# Altium schematic sheet Cooling_control.SchDoc: Cooling control
size A4; Engineer: Danel Tiitma; DocumentNumber: 8; Revision: 1; SheetNumber: 9; SheetTotal: 15
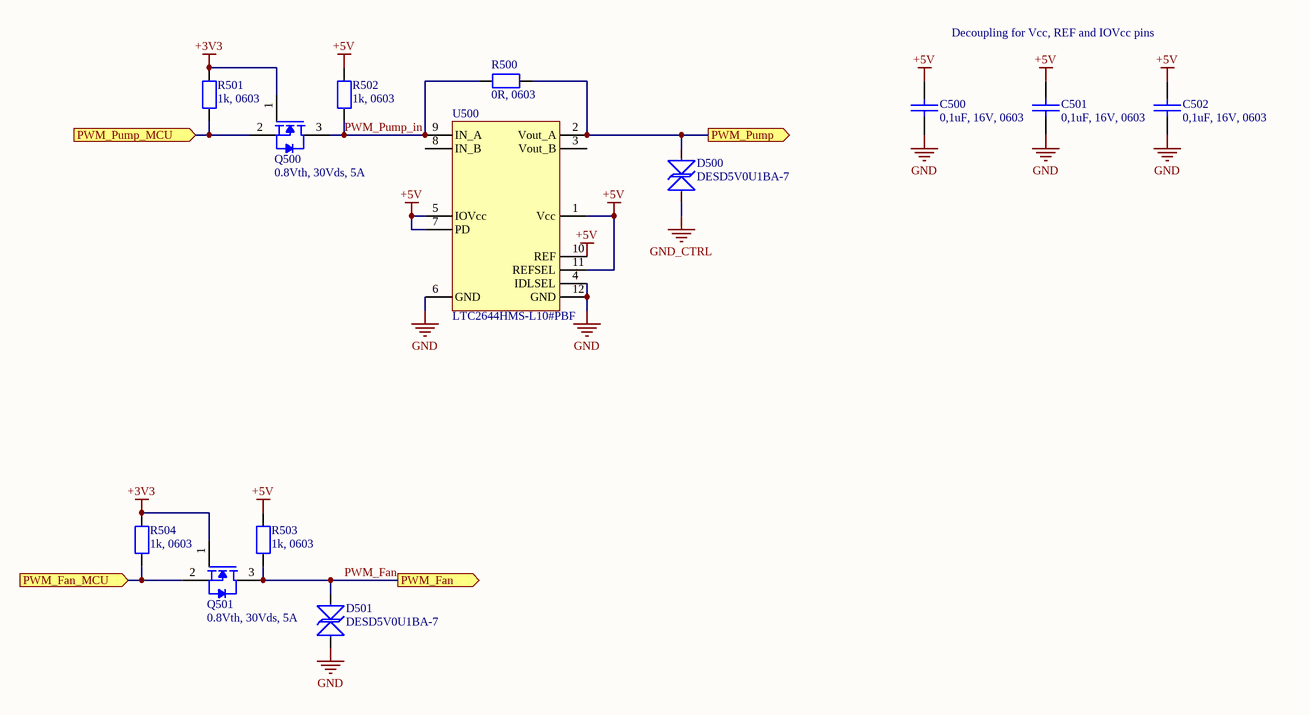
[diagram p0: Cooling_control.SchDoc]

## Parts
C500  0,1uF, 16V, 0603  [CAP [0603] 1608]
C501  0,1uF, 16V, 0603  [CAP [0603] 1608]
C502  0,1uF, 16V, 0603  [CAP [0603] 1608]
D500  DESD5V0U1BA-7  [SOD-323]
D501  DESD5V0U1BA-7  [SOD-323]
Q500  0.8Vth, 30Vds, 5A  [SOT23-3]
Q501  0.8Vth, 30Vds, 5A  [SOT23-3]
R500  0R, 0603  [RES [0603] 1608]
R501  1k, 0603  [RES [0603] 1608]
R502  1k, 0603  [RES [0603] 1608]
R503  1k, 0603  [RES [0603] 1608]
R504  1k, 0603  [RES [0603] 1608]
U500  LTC2644HMS-L10#PBF  [MSOP-12]

## Ports
PWM_Fan (out), PWM_Fan_MCU (in), PWM_Pump (out), PWM_Pump_MCU (in)

## Nets
+3V3: Q500.1(G) Q501.1(G) R501.2 R504.2
+5V: C500.1 C501.1 C502.1 R502.2 R503.2 U500.1(Vcc) U500.5(IOVcc) U500.7(PD) U500.10(REF) U500.11(REFSEL)
GND: C500.2 C501.2 C502.2 D501.2 U500.4(IDLSEL) U500.6(GND) U500.12(GND)
GND_CTRL: D500.2
PWM_Fan: D501.1 Q501.3(D) R503.1 ; port PWM_Fan
PWM_Fan_MCU: Q501.2(S) R504.1 ; port PWM_Fan_MCU
PWM_Pump: D500.1 R500.2 U500.2(Vout_A) ; port PWM_Pump
PWM_Pump_in: Q500.3(D) R500.1 R502.1 U500.9(IN_A)
PWM_Pump_MCU: Q500.2(S) R501.1 ; port PWM_Pump_MCU

Not connected (* = marked no-connect by the designer): U500 3(Vout_B) 8(IN_B)

## Notes on the sheet
- Decoupling for Vcc, REF and IOVcc pins
- Engineer:
- Date:
- Rev:

## Library data of the parts
C500-C502 = CMP-001-00084-16: Default capacitor part; Supplier: *; Supplier Part Number: *; Manufacturer Part Number: *
D500 D501 = CMP-004-00046-2: Trans Voltage Suppressor Diode, 5V V(RWM), Bidirectional, 1 Element, Silicon; Manufacturer: Diodes Inc.; Manufacturer Part Number: DESD5V0U1BA-7; Price: 0,233; Datasheet: https://www.diodes.com/assets/Datasheets/DESD5V0U1BA.pdf; Supplier: Mouser; Supplier Part Number: 621-DESD5V0U1BA-7
Q500 Q501 = CMP-013-00008-1: Small Signal Field-Effect Transistor; Manufacturer Part Number: IRLML6344TRPBF; Supplier Part Number: 942-IRLML6344TRPBF; Supplier: Mouser
R500-R504 = CMP-009-00038-12: Standard resistor part; Supplier Part Number: *; Manufacturer Part Number: *; Supplier: *
U500 = CMP-00030-00005-1: IC DAC 10-BIT VOUT 12MSOP; Manufacturer: Mouser; Price: 8,50; Manufacturer Part Number: LTC2644HMS-L10#PBF; Supplier: Mouser; Supplier Part Number: 584-C2644HMS-L10PBF; Datasheet: https://www.mouser.ee/datasheet/2/609/LTC2644-3124593.pdf